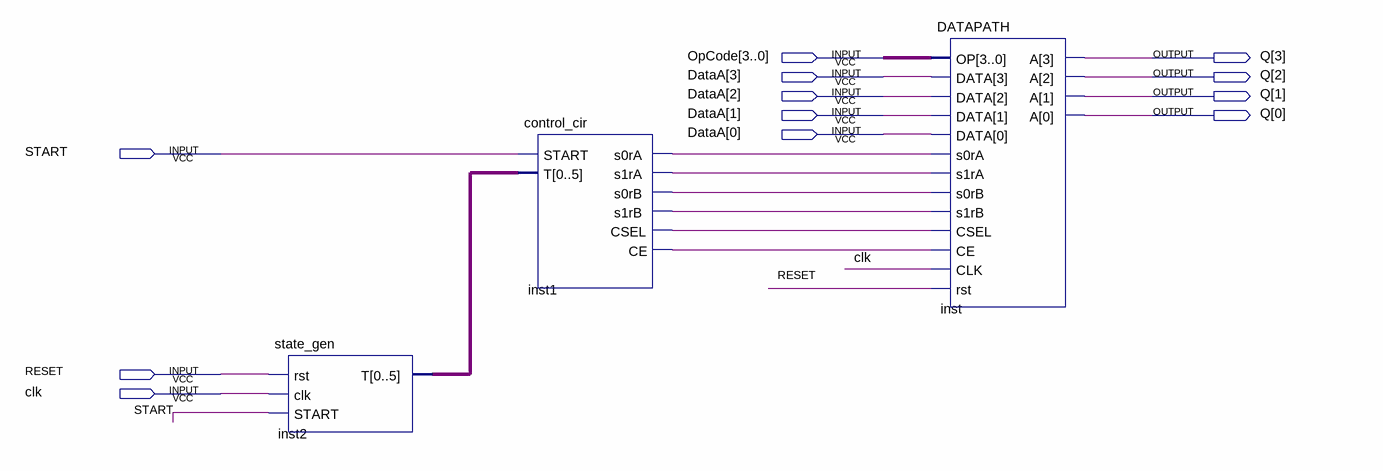
[diagram p0: schematic sheet]
// Quartus schematic alu_design.bdf as structural Verilog: 3 symbols, 12 pins
module alu_design (
  input  [3:0] OpCode,
  input  [3:0] DataA,
  input  START,
  input  RESET,
  input  clk,
  output [3:0] Q
);

  wire inst1_ce, inst1_csel, inst1_s0ra, inst1_s0rb, inst1_s1ra, inst1_s1rb;
  wire [5:0] inst2_t;

  state_gen inst2 (.rst(RESET), .clk(clk), .START(START), .T(inst2_t));
  control_cir inst1 (
    .START(START), .T(inst2_t), .s0rA(inst1_s0ra), .s1rA(inst1_s1ra), .s0rB(inst1_s0rb), .s1rB(inst1_s1rb),
    .CSEL(inst1_csel), .CE(inst1_ce));
  DATAPATH inst (
    .OP(OpCode), .DATA(DataA), .s0rA(inst1_s0ra), .s1rA(inst1_s1ra), .s0rB(inst1_s0rb), .s1rB(inst1_s1rb),
    .CSEL(inst1_csel), .CE(inst1_ce), .CLK(clk), .rst(RESET), .A(Q));
endmodule
